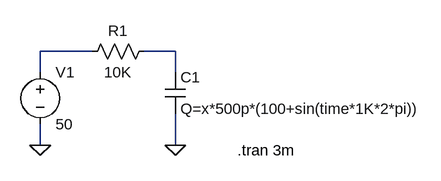
[diagram p0: schematic ArbitraryCapacitance2.asc]
ArbitraryCapacitance2.asc, the LTspice schematic file:
Version 4
SHEET 1 920 680
WIRE 272 224 272 192
WIRE 272 336 272 304
WIRE 352 192 272 192
WIRE 480 192 432 192
WIRE 480 224 480 192
WIRE 480 336 480 288
FLAG 272 336 0
FLAG 480 336 0
SYMBOL cap 464 224 R0
SYMATTR InstName C1
SYMATTR Value Q=x*500p*(100+sin(time*1K*2*pi))
SYMBOL voltage 272 208 R0
SYMATTR InstName V1
SYMATTR Value 50
SYMBOL res 336 208 R270
WINDOW 0 32 56 VTop 0
WINDOW 3 0 56 VBottom 0
SYMATTR InstName R1
SYMATTR Value 10K
TEXT 576 344 Left 0 !.tran 3m

The netlist it stands for:
* ArbitraryCapacitance2.asc
C1 N002 0 Q=x*500p*(100+sin(time*1K*2*pi))
V1 N001 0 50
R1 N001 N002 10K
.tran 3m
.backanno
.end